# Altium schematic sheet STRWL-S01-V01-Master1.SchDoc
size A3; Version: 00; Project: ####; PageSetup: Record=PageOptions|CenterHorizontal=True|CenterVertical=True|PrintScale=0.97|XCorrection=1.00|YCorrection=1.00|PrintKind=0|BorderSize=5000000|LeftOffset=0|BottomOffset=0|Orientation=2|PaperLength=1000|PaperWidth=1000|Scale=100|PaperSource=7|PrintQuality=-4|MediaType=1|DitherType=10|PaperKind=A4|PrintScaleMode=1
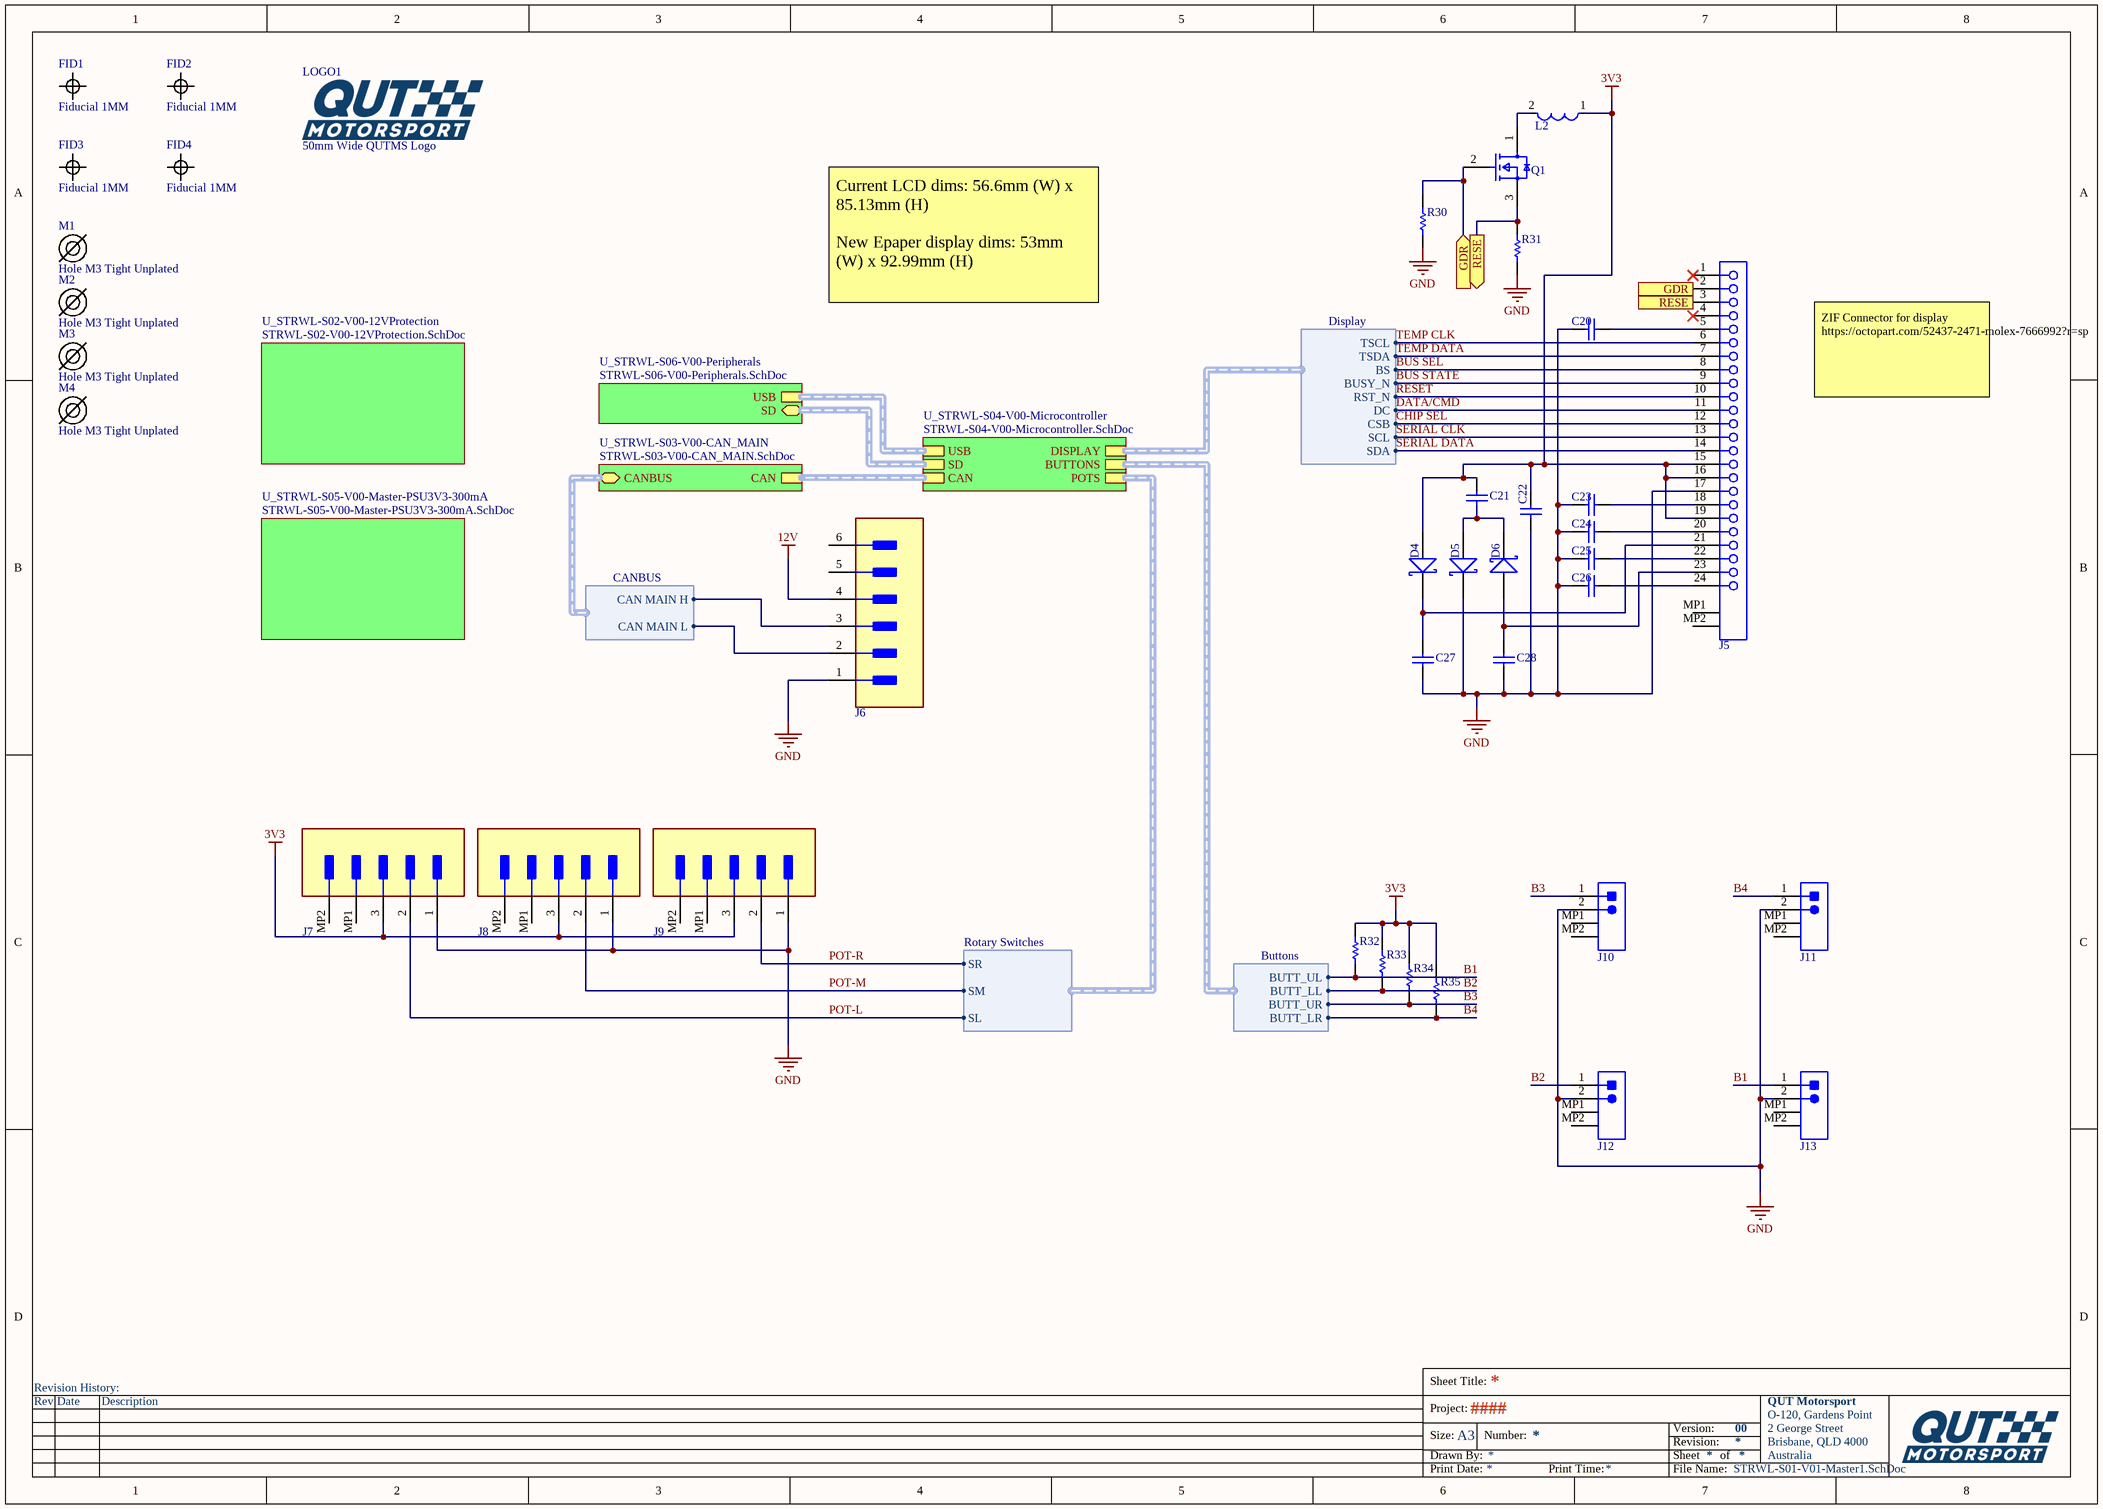
[diagram p0: STRWL-S01-V01-Master1.SchDoc]

## Parts
C20  1uF 25V 5% X7R 0603  [Cap_Ceramic_0603]  (value not drawn)
C21  4u7 50V 5% X7R 0603  [Cap_Ceramic_0603]  (value not drawn)
C22  1uF 25V 5% X7R 0603  [Cap_Ceramic_0603]  (value not drawn)
C23  1uF 25V 5% X7R 0603  [Cap_Ceramic_0603]  (value not drawn)
C24  1uF 25V 5% X7R 0603  [Cap_Ceramic_0603]  (value not drawn)
C25  1uF 25V 5% X7R 0603  [Cap_Ceramic_0603]  (value not drawn)
C26  1uF 25V 5% X7R 0603  [Cap_Ceramic_0603]  (value not drawn)
C27  1uF 25V 5% X7R 0603  [Cap_Ceramic_0603]  (value not drawn)
C28  1uF 25V 5% X7R 0603  [Cap_Ceramic_0603]  (value not drawn)
D4  STPS0530Z  [SOD123]  (value not drawn)
D5  STPS0530Z  [SOD123]  (value not drawn)
D6  STPS0530Z  [SOD123]  (value not drawn)
FID1  Fiducial 1MM  [FIDUCIAL 1MM]  (no BOM)
FID2  Fiducial 1MM  [FIDUCIAL 1MM]  (no BOM)
FID3  Fiducial 1MM  [FIDUCIAL 1MM]  (no BOM)
FID4  Fiducial 1MM  [FIDUCIAL 1MM]  (no BOM)
J5  52437-2471  [MOLX-52437-2471]  (value not drawn)
J6  JST PH 4 Way SMD Header  [JST 4P SMD]  (value not drawn)
J7  JST PH 3 Way SMD Header  [JST 3P SMD]  (value not drawn)
J8  JST PH 3 Way SMD Header  [JST 3P SMD]  (value not drawn)
J9  JST PH 3 Way SMD Header  [JST 3P SMD]  (value not drawn)
J10  JST PH 2 Way SMD Header  [JST 2P SMD]  (value not drawn)
J11  JST PH 2 Way SMD Header  [JST 2P SMD]  (value not drawn)
J12  JST PH 2 Way SMD Header  [JST 2P SMD]  (value not drawn)
J13  JST PH 2 Way SMD Header  [JST 2P SMD]  (value not drawn)
L2  LQM21FN100M70L  [Murata_LQM21FN_70_IPC_C]  (value not drawn)
LOGO1  50mm Wide QUTMS Logo  [QUTMS LOGO 50MM]  (no BOM)
M1  Hole M3 Tight Unplated  [M3.2 UNPLATED]
M2  Hole M3 Tight Unplated  [M3.2 UNPLATED]
M3  Hole M3 Tight Unplated  [M3.2 UNPLATED]
M4  Hole M3 Tight Unplated  [M3.2 UNPLATED]
Q1  MOSFET N-CH 30V 4A SOT323  [Diodes_SOT323_0]  (value not drawn)
R30  10k 1% 0603  [Res_ThinFilm_0603]  (value not drawn)
R31  0R47 5% 0603  [Res_ThinFilm_0603]  (value not drawn)
R32  10k 5% 0603  [Res_ThinFilm_0603]  (value not drawn)
R33  10k 5% 0603  [Res_ThinFilm_0603]  (value not drawn)
R34  10k 5% 0603  [Res_ThinFilm_0603]  (value not drawn)
R35  10k 5% 0603  [Res_ThinFilm_0603]  (value not drawn)

## Sub-sheets
U_STRWL-S02-V00-12VProtection = STRWL-S02-V00-12VProtection.SchDoc: no entries
U_STRWL-S03-V00-CAN_MAIN = STRWL-S03-V00-CAN_MAIN.SchDoc: CANBUS (bidir, harness CANBUS), CAN (harness CAN)
U_STRWL-S04-V00-Microcontroller = STRWL-S04-V00-Microcontroller.SchDoc: CAN (harness CAN), USB (harness USB), SD (harness SD), DISPLAY (harness Display), BUTTONS (harness Buttons), POTS (harness Rotary Switches)
U_STRWL-S05-V00-Master-PSU3V3-300mA = STRWL-S05-V00-Master-PSU3V3-300mA.SchDoc: no entries
U_STRWL-S06-V00-Peripherals = STRWL-S06-V00-Peripherals.SchDoc: USB (harness USB), SD (bidir, harness SD)

## Ports
GDR (in), GDR (out), RESE (in), RESE (out)

## Harnesses
CANBUS: CAN MAIN H, CAN MAIN L
Display: CSB, SCL, SDA, TSCL, TSDA, BS, BUSY_N, RST_N, DC
Buttons: BUTT_UL, BUTT_LL, BUTT_UR, BUTT_LR
Rotary Switches: SL, SM, SR

## Nets
3V3: C21.2 C22.2 D4.A J5.15 J5.16 J5.19 J7.3 J8.3 J9.3 L2.1 R32.1 R33.1 R34.2 R35.2
12V: J6.4
GND: C20.1 C22.1 C23.1 C24.1 C25.1 C26.1 C27.1 C28.1 D5.K J5.17 J6.1 J7.1 J8.1 J9.1 J10.2 J11.2 J12.2 J13.2 R30.2 R31.1
B1: J13.1 R32.2 ; sheet U_STRWL-S04-V00-Microcontroller/BUTTONS.BUTT_UL
B2: J12.1 R33.2 ; sheet U_STRWL-S04-V00-Microcontroller/BUTTONS.BUTT_LL
B3: J10.1 R34.1 ; sheet U_STRWL-S04-V00-Microcontroller/BUTTONS.BUTT_UR
B4: J11.1 R35.1 ; sheet U_STRWL-S04-V00-Microcontroller/BUTTONS.BUTT_LR
BUS SEL: J5.8 ; sheet U_STRWL-S04-V00-Microcontroller/DISPLAY.BS
BUS STATE: J5.9 ; sheet U_STRWL-S04-V00-Microcontroller/DISPLAY.BUSY_N
CHIP SEL: J5.12 ; sheet U_STRWL-S04-V00-Microcontroller/DISPLAY.CSB
DATA/CMD: J5.11 ; sheet U_STRWL-S04-V00-Microcontroller/DISPLAY.DC
GDR: J5.2 Q1.2(G) R30.1 ; port GDR
POT-L: J7.2 ; sheet U_STRWL-S04-V00-Microcontroller/POTS.SL
POT-M: J8.2 ; sheet U_STRWL-S04-V00-Microcontroller/POTS.SM
POT-R: J9.2 ; sheet U_STRWL-S04-V00-Microcontroller/POTS.SR
RESE: J5.3 Q1.3(S) R31.2 ; port RESE
RESET: J5.10 ; sheet U_STRWL-S04-V00-Microcontroller/DISPLAY.RST_N
SERIAL CLK: J5.13 ; sheet U_STRWL-S04-V00-Microcontroller/DISPLAY.SCL
SERIAL DATA: J5.14 ; sheet U_STRWL-S04-V00-Microcontroller/DISPLAY.SDA
TEMP CLK: J5.6 ; sheet U_STRWL-S04-V00-Microcontroller/DISPLAY.TSCL
TEMP DATA: J5.7 ; sheet U_STRWL-S04-V00-Microcontroller/DISPLAY.TSDA
NetC20_2: C20.2 J5.5
NetC21_1: C21.1 D5.A D6.K
NetC23_2: C23.2 J5.18
NetC24_2: C24.2 J5.20
NetC25_2: C25.2 J5.22
NetC26_2: C26.2 J5.24
NetC27_2: C27.2 D4.K J5.21
NetC28_2: C28.2 D6.A J5.23
NetJ6_2: J6.2 ; sheet U_STRWL-S03-V00-CAN_MAIN/CANBUS.CAN MAIN L
NetJ6_3: J6.3 ; sheet U_STRWL-S03-V00-CAN_MAIN/CANBUS.CAN MAIN H
NetL2_2: L2.2 Q1.1(D)

Not connected (* = marked no-connect by the designer): J5 1* 4* MP1 MP2; J6 5(MNT_1) 6(MNT_2); J7 MP1(MNT_1) MP2(MNT_2); J8 MP1(MNT_1) MP2(MNT_2); J9 MP1(MNT_1) MP2(MNT_2); J10 MP1 MP2; J11 MP1 MP2; J12 MP1 MP2; J13 MP1 MP2

## Buses and harness runs
harness sheet U_STRWL-S03-V00-CAN_MAIN/CAN = sheet U_STRWL-S04-V00-Microcontroller/CAN
harness sheet U_STRWL-S04-V00-Microcontroller/SD = sheet U_STRWL-S06-V00-Peripherals/SD
harness sheet U_STRWL-S04-V00-Microcontroller/USB = sheet U_STRWL-S06-V00-Peripherals/USB

## Notes on the sheet
- Current LCD dims: 56.6mm (W) x 85.13mm (H)
  New Epaper display dims: 53mm (W) x 92.99mm (H)
- ZIF Connector for display
  https://octopart.com/52437-2471-molex-7666992?r=sp
- Revision History:
- Sheet Title:
- Rev
- Date
- Description
- Project:
- Size:
- Drawn By:
- A3
- Number:
- Revision:
- Sheet
- Version:
- of
- QUT Motorsport
- O-120, Gardens Point
- 2 George Street
- Brisbane, QLD 4000
- Australia
- Print Date:
- Print Time:
- File Name:

## Library data of the parts
C20 C22-C28 = 1uF 25V 5% X7R 0603: Capacitor, Ceramic, SMD, 1uF, 25V, 5%, X7R, 0603
C21 = 4u7 50V 5% X7R 0603: Capacitor, Ceramic, SMD, 4u7, 50V, 5%, X7R, 0603
D4-D6 = STPS0530Z: Diode, Schottky Barrier Rectifier, 30 V, 0.5 A, STPS0530Z
J5 = 52437-2471: 0.5 mm Pitch Easy-On(TM) Type FPC Connector, Right Angle, ZIF, SMT, Bottom Contact, 24 Circuits, -40 to 85 degC, ELV and RoHS Compliant, Tape and Reel; Manufacturer: Molex; Durability (mating cycles max): 20; Material - Metal: Phosphor Bronze; Polarized to PCB: Yes; Voltage (Max): 50V; Entry Angle: 90degrees Angle; PCB Locator: No; Material - Plating Termination: Gold; Current (Max per Contact): 0.5A; PCB Retention: None; Pitch - Mating Interface: 0.50mm; Circuits (Loaded): 24; Contact Position: Bottom; PartNumber: 52437-2471; ComponentLink1Description: Manufacturer URL; ComponentLink2Description: Datasheet; ComponentLink3URL: http://www.molex.com/pdm_docs/sd/524372471_sd.pdf; ComponentLink3Description: Package Specification; ComponentLink1URL: http://www.molex.com/molex/index.jsp; Packing: Tape and Reel; Number of Rows: 1; ComponentLink2URL: http://www.molex.com/webdocs/datasheets/pdf/en-us/0524372471_FFC_FPC_CONNECTORS.pdf; PackageVersion: Rev. E, 07/2013; RoHS: TRUE; Material - Plating Mating: Gold; Orientation: Right Angle; Stackable: No; Mounting Technology: Surface Mount; PackageReference: 52437-2471; PackageDescription: 24-Lead FPC Connector, Pitch 0.5 mm
J10-J13 = JST PH 2 Way SMD Header: PartNumber: S2B-PH-SM4-TB(LF)(SN); Current Rating: 3 A; RoHSCompliant: True; Min Operating Temperature: -65degC; Width: 2.34 mm; Pins: 40; ComponentLink1Description: Manufacturer URL; ComponentLink2Description: Datasheet; DatasheetVersion: Dec-12; ComponentLink1URL: http://www.jst.com/home2.html; Contact Plating: Tin; ComponentLink2URL: http://www.jst-mfg.com/product/pdf/eng/ePH.pdf; PackageReference: S2B-PH-SM4-TB(LF)(SN)-2; Mount: Through Hole; Contact Finish: Lead; Length: 101.19 mm; Radiation Hardening: No; Lead Pitch: 0.1 inch; Max Operating Temperature: 105degC; Colour: Black; Package Quantity: 100; Height: 8.13 mm; Packaging: Bulk; PackageDescription: Male Header, Pitch 2 mm, 1 x 2 Position, Height 5.5 mm; Contact Material: Bronze
LOGO1 = QUTMS Logo 50mm
M1-M4 = Hole M3 Tight Unplated: M3.2 Hole, No Plating
Q1 = DMN3065LW-13: N-Channel 30V 4A (Ta) 770mW (Ta) Surface Mount SOT-323
R30 = 10k 1% 0603: Resistor, SMD, 10k, 0.1W, 1%, 0603
R31 = 0R47 5% 0603_1: Resistor, SMD, 0R, 0.1W, 5%, 0603
R32-R35 = 10k 5% 0603: Resistor, SMD, 10k, 0.1W, 5%, 0603